# Altium schematic sheet MAZ000180 - Diagrama eléctrico.SchDoc: MAZ000180 - Diagrama eléctrico
size A; ApprovedBy: Christian Ledwidth; CheckedBy: Nahuel Martinez; Author: Santiago Marti; CompanyName: Body Health; DrawnBy: Santiago Marti; Revision: A; SheetNumber: 2; SheetTotal: 2
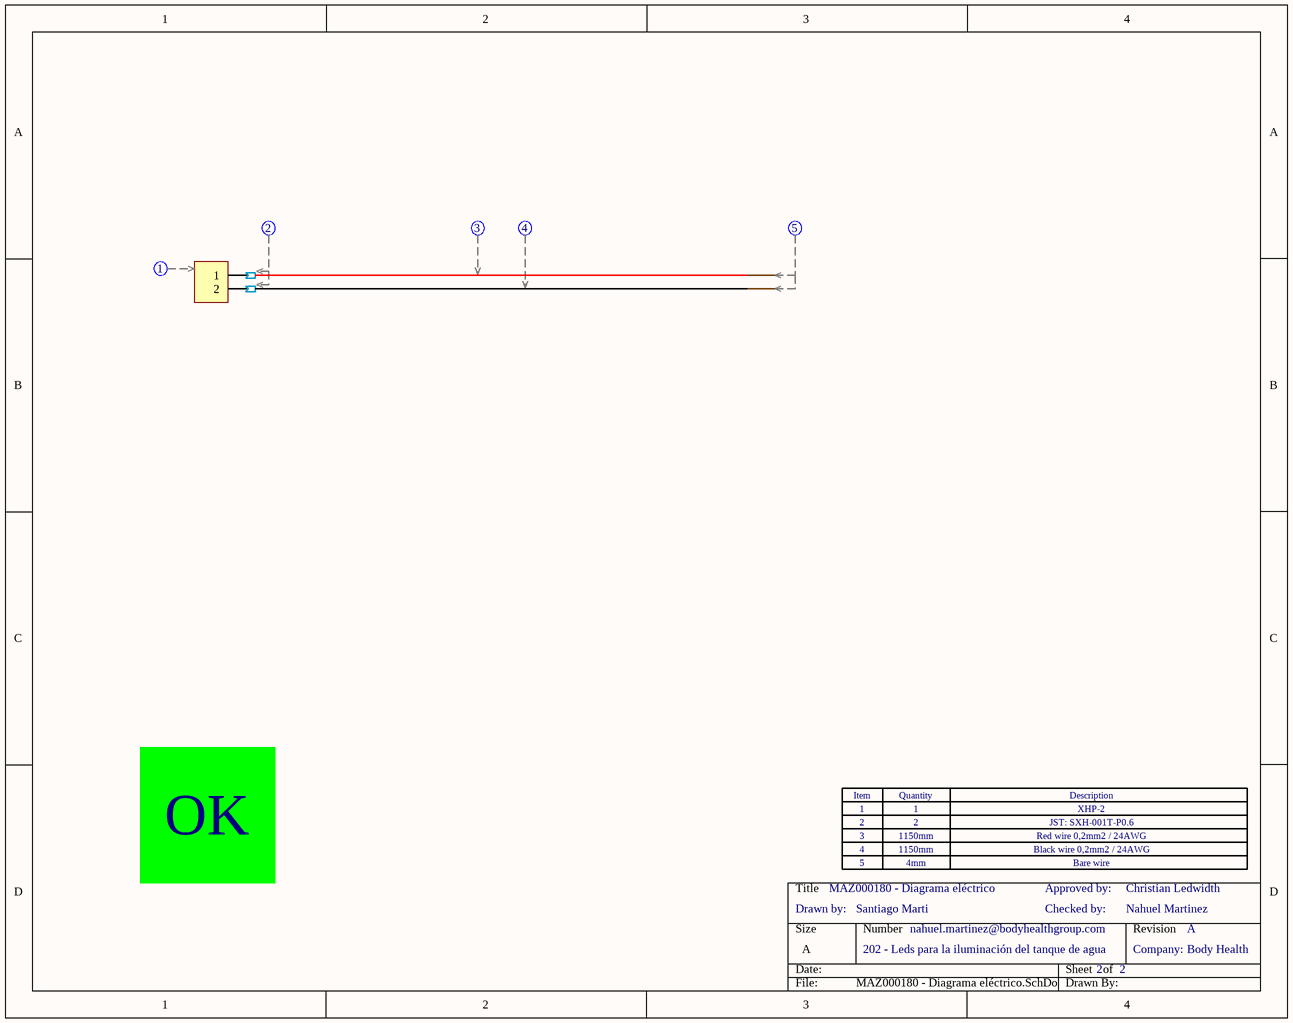
[diagram p0: MAZ000180 - Diagrama eléctrico.SchDoc]

## Parts
Con2  XHP-2  (value not drawn)  (parts C,D of 4)
Soc1  sock_XHP_SXH-002T-P0.6  (value not drawn)  (parts A,B of 2)
Soc2  sock_XHP_SXH-002T-P0.6  (value not drawn)  (parts A,B of 2)
Soc3  sock_XHP_SXH-002T-P0.6  (value not drawn)  (part A of 2)
Soc?  sock_XHP_SXH-002T-P0.6  (value not drawn)  (part A of 2)
Zoc1  Zócalo_Header  (value not drawn)
Zoc2  Zócalo_Item  (value not drawn)
Zoc3  Zócalo_Item  (value not drawn)
Zoc4  Zócalo_Item  (value not drawn)
Zoc5  Zócalo_Item  (value not drawn)
Zoc?  Zócalo_Item  (value not drawn)

## Nets
NetCon2_1: Con2.1 Soc1.0
NetCon2_2: Con2.2 Soc2.0

Not connected (* = marked no-connect by the designer): Soc1 1; Soc2 1

## Notes on the sheet
- OK
- 1
- 2
- 3
- 1150mm
- XHP-2
- JST: SXH-001T-P0.6
- Red wire 0,2mm2 / 24AWG
- Drawn by:
- 4
- 5
- 4mm
- Checked by:
- Approved by:
- Black wire 0,2mm2 / 24AWG
- Bare wire
- 202 - Leds para la iluminación del tanque de agua
- nahuel.martinez@bodyhealthgroup.com
- Company:
- (in symbol Zócalo_Header) Item; Quantity; Description

## Library data of the parts
Con2 = XHP-2: CONN HOUSING 2.5MM 2POS; Fabricante: JST Sales America Inc.; CallOut: 1; Cod.DigiKey: 455-2266-ND; Cod.Fabricante: XHP-2; ComponentLink1Description: Manufacturer Link; ComponentLink1URL: http://www.jst-mfg.com/product/pdf/eng/eXH.pdf; DIGIKEYx50: 0.05620; DIGIKEYx100: NO
Soc1 = sock_XHP_SXH-002T-P0.6: CONN SOCKET 26-30AWG CRIMP TIN; Fabricante: JST Sales America Inc.; CallOut: 2; Cod.DigiKey: 455-2261-1-ND; Cod.Fabricante: SXH-002T-P0.6; ComponentLink1Description: Manufacturer Link; ComponentLink1URL: http://www.jst-mfg.com/product/pdf/eng/eXH.pdf; DIGIKEYx100: 0.03300; DIGIKEYx50: 0.03420
Soc2 = sock_XHP_SXH-002T-P0.6: CONN SOCKET 26-30AWG CRIMP TIN; Fabricante: JST Sales America Inc.; CallOut: 3; Cod.DigiKey: 455-2261-1-ND; Cod.Fabricante: SXH-002T-P0.6; ComponentLink1Description: Manufacturer Link; ComponentLink1URL: http://www.jst-mfg.com/product/pdf/eng/eXH.pdf; DIGIKEYx100: 0.03300; DIGIKEYx50: 0.03420
Soc3 = sock_XHP_SXH-002T-P0.6: CONN SOCKET 26-30AWG CRIMP TIN; Fabricante: JST Sales America Inc.; CallOut: 4; Cod.DigiKey: 455-2261-1-ND; Cod.Fabricante: SXH-002T-P0.6; ComponentLink1Description: Manufacturer Link; ComponentLink1URL: http://www.jst-mfg.com/product/pdf/eng/eXH.pdf; DIGIKEYx100: 0.03300; DIGIKEYx50: 0.03420
Soc? = sock_XHP_SXH-002T-P0.6: CONN SOCKET 26-30AWG CRIMP TIN; Fabricante: JST Sales America Inc.; CallOut: 5; Cod.DigiKey: 455-2261-1-ND; Cod.Fabricante: SXH-002T-P0.6; ComponentLink1Description: Manufacturer Link; ComponentLink1URL: http://www.jst-mfg.com/product/pdf/eng/eXH.pdf; DIGIKEYx100: 0.03300; DIGIKEYx50: 0.03420
Zoc1 = Zócalo_Header: Header para el zócalo de referencias
Zoc2-Zoc5 Zoc? = Zócalo_Item: Ítem para el zócalo de referencias; Desginator: *; Quantity: *; ItemDescription: *